# EAGLE schematic 15-Lower Deck Cab bus Rev 1 (EAGLE 9.1.3)
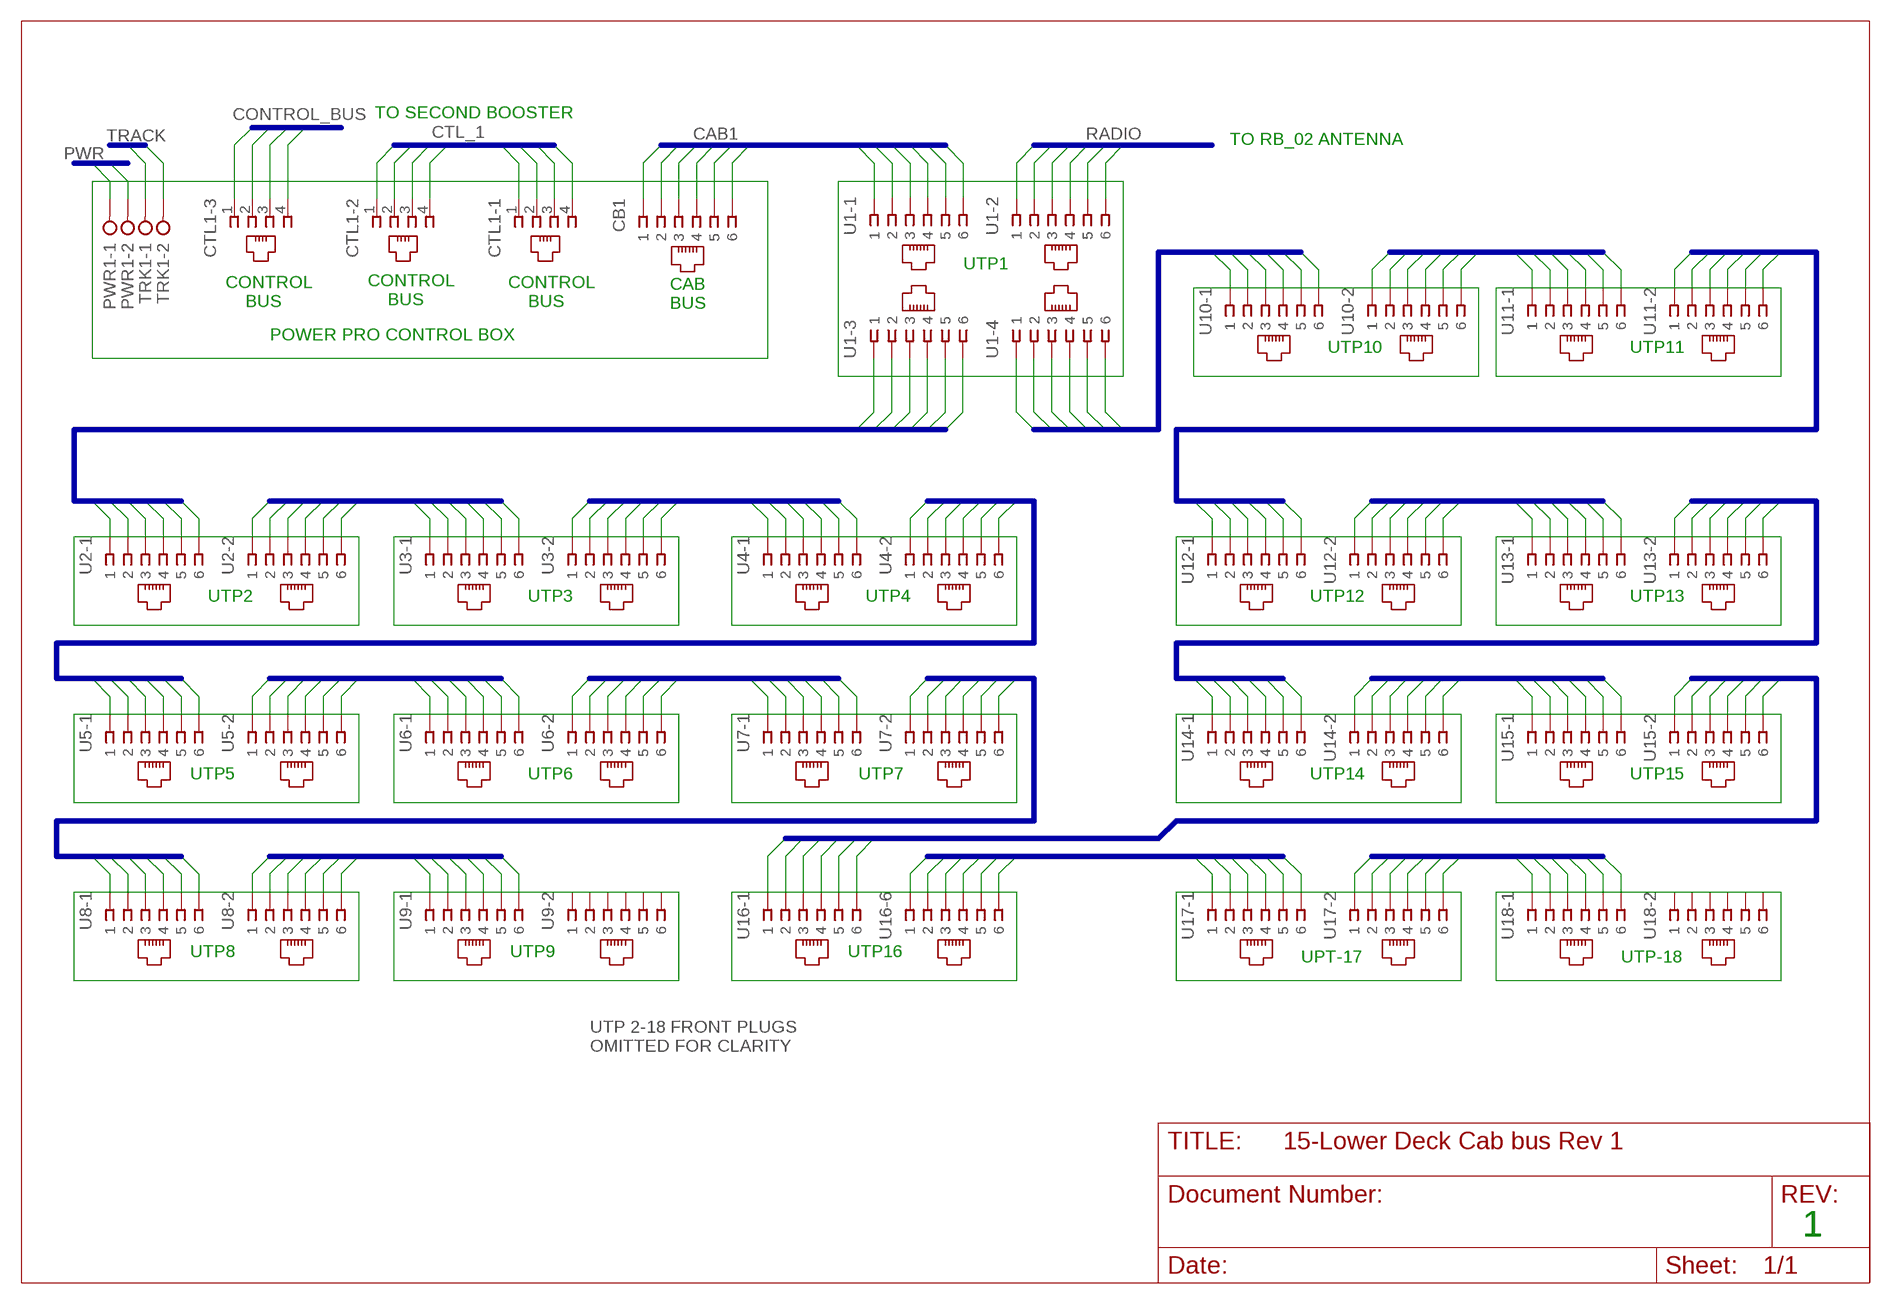
[diagram p0: schematic, sheet 1]

## Parts
CB1  RJ11-2L-B  [RJ11-NO_SHIELD]
CTL1-1  14867  [14867]
CTL1-2  14867  [14867]
CTL1-3  14867  [14867]
PWR1  2_TERMINALS  [W237-4P]
TRK1  2_TERMINALS  [W237-4P]
U1-1  RJ11-2L-B  [RJ11-NO_SHIELD]
U1-2  RJ11-2L-B  [RJ11-NO_SHIELD]
U1-3  RJ11-2L-B  [RJ11-NO_SHIELD]
U1-4  RJ11-2L-B  [RJ11-NO_SHIELD]
U2-1  RJ11-2L-B  [RJ11-NO_SHIELD]
U2-2  RJ11-2L-B  [RJ11-NO_SHIELD]
U3-1  RJ11-2L-B  [RJ11-NO_SHIELD]
U3-2  RJ11-2L-B  [RJ11-NO_SHIELD]
U4-1  RJ11-2L-B  [RJ11-NO_SHIELD]
U4-2  RJ11-2L-B  [RJ11-NO_SHIELD]
U5-1  RJ11-2L-B  [RJ11-NO_SHIELD]
U5-2  RJ11-2L-B  [RJ11-NO_SHIELD]
U6-1  RJ11-2L-B  [RJ11-NO_SHIELD]
U6-2  RJ11-2L-B  [RJ11-NO_SHIELD]
U7-1  RJ11-2L-B  [RJ11-NO_SHIELD]
U7-2  RJ11-2L-B  [RJ11-NO_SHIELD]
U8-1  RJ11-2L-B  [RJ11-NO_SHIELD]
U8-2  RJ11-2L-B  [RJ11-NO_SHIELD]
U9-1  RJ11-2L-B  [RJ11-NO_SHIELD]
U9-2  RJ11-2L-B  [RJ11-NO_SHIELD]
U10-1  RJ11-2L-B  [RJ11-NO_SHIELD]
U10-2  RJ11-2L-B  [RJ11-NO_SHIELD]
U11-1  RJ11-2L-B  [RJ11-NO_SHIELD]
U11-2  RJ11-2L-B  [RJ11-NO_SHIELD]
U12-1  RJ11-2L-B  [RJ11-NO_SHIELD]
U12-2  RJ11-2L-B  [RJ11-NO_SHIELD]
U13-1  RJ11-2L-B  [RJ11-NO_SHIELD]
U13-2  RJ11-2L-B  [RJ11-NO_SHIELD]
U14-1  RJ11-2L-B  [RJ11-NO_SHIELD]
U14-2  RJ11-2L-B  [RJ11-NO_SHIELD]
U15-1  RJ11-2L-B  [RJ11-NO_SHIELD]
U15-2  RJ11-2L-B  [RJ11-NO_SHIELD]
U16-1  RJ11-2L-B  [RJ11-NO_SHIELD]
U16-6  RJ11-2L-B  [RJ11-NO_SHIELD]
U17-1  RJ11-2L-B  [RJ11-NO_SHIELD]
U17-2  RJ11-2L-B  [RJ11-NO_SHIELD]
U18-1  RJ11-2L-B  [RJ11-NO_SHIELD]
U18-2  RJ11-2L-B  [RJ11-NO_SHIELD]

## Nets
B$1: U1-3.1 U1-3.2 U1-3.3 U1-3.4 U1-3.5 U1-3.6 U2-1.1 U2-1.2 U2-1.3 U2-1.4 U2-1.5 U2-1.6
B$2: U2-2.1 U2-2.2 U2-2.3 U2-2.4 U2-2.5 U2-2.6
B$4: U3-1.1 U3-1.2 U3-1.3 U3-1.4 U3-1.5 U3-1.6
B$5: U1-4.1 U1-4.2 U1-4.3 U1-4.4 U1-4.5 U1-4.6 U3-2.1 U3-2.2 U3-2.3 U3-2.4 U3-2.5 U3-2.6
B$6: U4-1.1 U4-1.2 U4-1.3 U4-1.4 U4-1.5 U4-1.6
B$7: U4-2.1 U4-2.2 U4-2.3 U4-2.4 U4-2.5 U4-2.6 U16-1.1 U16-1.2 U16-1.3 U16-1.4 U16-1.5 U16-1.6
B$8: U7-1.1 U7-1.2 U7-1.3 U7-1.4 U7-1.5 U7-1.6
B$9: U7-2.1 U7-2.2 U7-2.3 U7-2.4 U7-2.5 U7-2.6
B$10: U6-1.1 U6-1.2 U6-1.3 U6-1.4 U6-1.5 U6-1.6 U16-6.1 U16-6.2 U16-6.3 U16-6.4 U16-6.5 U16-6.6
B$11: U6-2.1 U6-2.2 U6-2.3 U6-2.4 U6-2.5 U6-2.6 U17-2.1 U17-2.2 U17-2.3 U17-2.4 U17-2.5 U17-2.6
B$12: U5-1.1 U5-1.2 U5-1.3 U5-1.4 U5-1.5 U5-1.6
B$13: U5-2.1 U5-2.2 U5-2.3 U5-2.4 U5-2.5 U5-2.6
B$14: U8-1.1 U8-1.2 U8-1.3 U8-1.4 U8-1.5 U8-1.6
B$15: U8-2.1 U8-2.2 U8-2.3 U8-2.4 U8-2.5 U8-2.6
B$16: U9-1.1 U9-1.2 U9-1.3 U9-1.4 U9-1.5 U9-1.6
B$17: U10-1.1 U10-1.2 U10-1.3 U10-1.4 U10-1.5 U10-1.6
B$18: U10-2.1 U10-2.2 U10-2.3 U10-2.4 U10-2.5 U10-2.6
B$19: U11-1.1 U11-1.2 U11-1.3 U11-1.4 U11-1.5 U11-1.6
B$20: U11-2.1 U11-2.2 U11-2.3 U11-2.4 U11-2.5 U11-2.6
B$21: U14-1.1 U14-1.2 U14-1.3 U14-1.4 U14-1.5 U14-1.6
B$22: U14-2.1 U14-2.2 U14-2.3 U14-2.4 U14-2.5 U14-2.6
B$25: U15-1.1 U15-1.2 U15-1.3 U15-1.4 U15-1.5 U15-1.6
B$26: U15-2.1 U15-2.2 U15-2.3 U15-2.4 U15-2.5 U15-2.6
B$27: U12-1.1 U12-1.2 U12-1.3 U12-1.4 U12-1.5 U12-1.6
B$28: U12-2.1 U12-2.2 U12-2.3 U12-2.4 U12-2.5 U12-2.6
B$29: U13-1.1 U13-1.2 U13-1.3 U13-1.4 U13-1.5 U13-1.6
B$30: U13-2.1 U13-2.2 U13-2.3 U13-2.4 U13-2.5 U13-2.6
CAB1: CB1.1 CB1.2 CB1.3 CB1.4 CB1.5 CB1.6 U1-1.2 U1-1.3 U1-1.4 U1-1.5 U1-1.6
CONTROL_BUS: CTL1-3.1 CTL1-3.2 CTL1-3.3 CTL1-3.4
CTL_1: CTL1-1.1 CTL1-1.2 CTL1-1.3 CTL1-1.4 CTL1-2.1 CTL1-2.2 CTL1-2.3 CTL1-2.4
N$2: U18-1.1 U18-1.2 U18-1.3 U18-1.4 U18-1.5 U18-1.6
N$11: U9-2.1 U9-2.2 U9-2.3 U9-2.4 U9-2.5 U9-2.6
PWR: PWR1.1 PWR1.4
TRACK: TRK1.1 TRK1.4
Unconnected: U1-1.1 U1-2.1 U1-2.2 U1-2.3 U1-2.4 U1-2.5 U1-2.6 U17-1.1 U17-1.2 U17-1.3 U17-1.4 U17-1.5 U17-1.6 U18-2.1 U18-2.2 U18-2.3 U18-2.4 U18-2.5 U18-2.6

## Buses
CTL_1
TRACK
PWR
CAB1
RADIO
B$1
B$2
B$3
B$4
B$5
B$6
B$7
CONTROL_BUS
B$8
B$9
B$10
B$11

## Notes on the sheet
- TO SECOND BOOSTER
- TO RB_02 ANTENNA
- UTP1
- CONTROL
      BUS
- CONTROL
      BUS
- CONTROL
      BUS
- CAB
  BUS
- POWER PRO CONTROL BOX
- UTP10 | UTP11
- UTP2 | UTP3 | UTP4 | UTP12 | UTP13
- UTP5 | UTP6 | UTP7 | UTP14 | UTP15
- UTP8 | UTP9 | UTP16
- UPT-17 | UTP-18
- UTP 2-18 FRONT PLUGS
  OMITTED FOR CLARITY
- 1

## Library data of the parts
CB1 U1-1-U1-4 U2-1 U2-2 U3-1 U3-2 U4-1 U4-2 U5-1 U5-2 U6-1 U6-2 U7-1 U7-2 U8-1 U8-2 U9-1 U9-2 U10-1 U10-2 U11-1 U11-2 U12-1 U12-2 U13-1 U13-2 U14-1 U14-2 U15-1 U15-2 U16-1 U16-6 U17-1 U17-2 U18-1 U18-2 = RMCQ  HO Layout:RJ11: CORCOM Modular RJ Jacks No Shield Source: www.tycoelectronics.com .. ENG_DS_1654001_1099_RJ_L_0507.pdf; MF: TYCO ELECTRONICS; MPN: RJ11-2L-B; OC_FARNELL: unknown; OC_NEWARK: 83F4463
CTL1-1-CTL1-3 = RMCQ  HO Layout:14867: RJ11 4pin connector Source: 4UCON TECHNOLOGY INC. 14867.pdf; OC_FARNELL: unknown; OC_NEWARK: unknown
PWR1 TRK1 = RMCQ  HO Layout:2_TERMINALS: 2 Terminal Block; OC_FARNELL: unknown; OC_NEWARK: unknown